# Altium schematic sheet ao.SchDoc
size A3; SheetNumber: 2; SheetTotal: 2
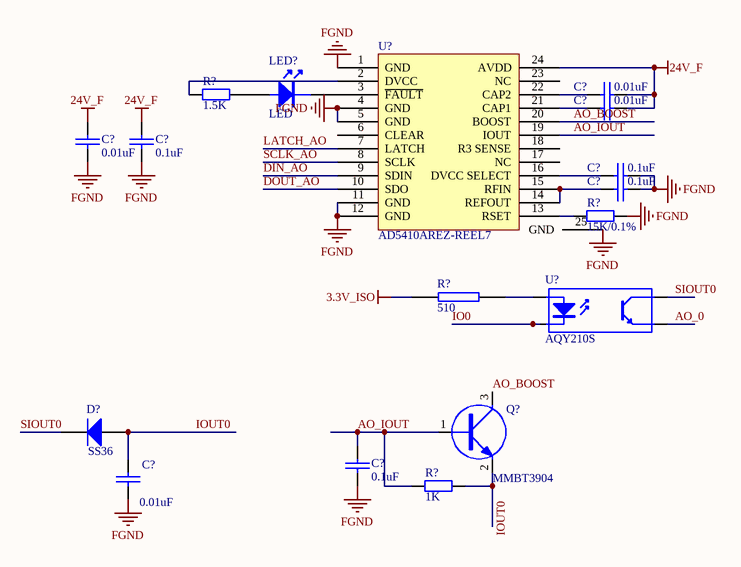
[diagram p0: ao.SchDoc]

## Parts
(Parts that share a designator on the sheet are numbered #1, #2 ... from top to bottom, then left to right.)
C?#1  0.01uF  [0603C]  (no BOM)
C?#2  0.01uF  [0603C]  (no BOM)
C?#3  0.01uF  [0603C]  (no BOM)
C?#4  0.1uF  [0603C]  (no BOM)
C?#5  0.1uF  [0603C]  (no BOM)
C?#6  0.1uF  [0603C]  (no BOM)
C?#7  0.1uF  [0603C]  (no BOM)
C?#8  0.01uF  [0603C]  (no BOM)
D?  SS36  [sma]  (no BOM)
LED?  LED  [0603LED]  (no BOM)
Q?  MMBT3904  [SOT23-3]  (no BOM)
R?#1  1.5K  [0603R]  (no BOM)
R?#2  15K/0.1%  [0603R]  (no BOM)
R?#3  510  [0603R]  (no BOM)
R?#4  1K  [0603R]  (no BOM)
U?#1  AD5410AREZ-REEL7  [AD5410AREZ-REEL7]  (no BOM)
U?#2  AQY210S  [sop4]  (no BOM)

## Nets
3.3V_ISO: R?#3.2
24V_F: C?#1.2 C?#2.2 C?#3.2 C?#4.2 U?#1.24(AVDD)
FGND: C?#3.1 C?#4.1 C?#5.2 C?#6.2 C?#7.1 C?#8.1 R?#2.2 U?#1.1(GND) U?#1.4(GND) U?#1.5(GND) U?#1.11(GND) U?#1.12(GND) U?#1.25(GND)
AO_0: U?#2.3(E)
AO_BOOST: Q?.3(C) U?#1.20(BOOST)
AO_IOUT: C?#7.2 Q?.1(B) R?#4.1 U?#1.19(IOUT)
DIN_AO: U?#1.9(SDIN)
DOUT_AO: U?#1.10(SDO)
IO0: U?#2.2(K)
IOUT0: C?#8.2 D?.1(A) Q?.2(E) R?#4.2
LATCH_AO: U?#1.7(LATCH)
SCLK_AO: U?#1.8(SCLK)
SIOUT0: D?.2(K) U?#2.4(C)
NetC?#1_1: C?#1.1 U?#1.22(CAP2)
NetC?#2_1: C?#2.1 U?#1.21(CAP1)
NetC?#5_1: C?#5.1 U?#1.16(DVCC_SELECT)
NetC?#6_1: C?#6.1 U?#1.14(REFOUT) U?#1.15(RFIN)
NetLED?_1: LED?.1 R?#1.2
NetLED?_2: LED?.2 U?#1.3(~{FAULT})
NetR?#1_1: R?#1.1 U?#1.2(DVCC)
NetR?#2_1: R?#2.1 U?#1.13(RSET)
NetR?#3_1: R?#3.1 U?#2.1(A)

Not connected (* = marked no-connect by the designer): U?#1 6(CLEAR) 17(NC) 18(R3_SENSE) 23(NC)

## Library data of the parts
C?#1-C?#8 = CAP: Capacitor
D? = Diode 1N4001: 1 Amp General Purpose Rectifier; Published: 8-Jun-2000; LatestRevisionDate: 17-Jul-2002; LatestRevisionNote: Re-released for DXP Platform.; DatasheetVersion: 1998; PackageVersion: Aug-1999; PackageReference: DO-41; Publisher: Altium Limited; Code_JEDEC: DO-204-AL; ComponentLink1Description: Manufacturer Link; ComponentLink1URL: http://www.fairchildsemi.com/; ComponentLink2Description: Datasheet; ComponentLink2URL: http://www.fairchildsemi.com/ds/1N%2F1N4001.pdf
Q? = NPN_MMBT3904
R?#1 R?#2 R?#4 = Res0805M
R?#3 = RES2
U?#2 = Optoisolator1: 4-Pin Phototransistor Optocoupler; Published: 24-Mar-1999; LatestRevisionDate: 04-Mar-2005; LatestRevisionNote: Sch pins 3 & 4 Swapped.; DatasheetVersion: Nov-2003; PackageReference: DIP-4; Publisher: Altium Limited